# Altium project SerDser.PrjPCB
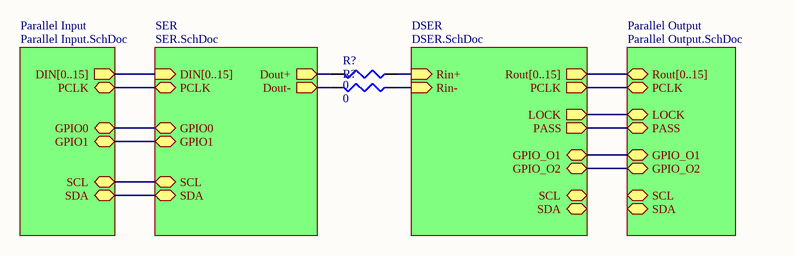
[diagram p0: Main.SchDoc]
5 sheets, 107 parts. Net scope: hierarchical (ports join the sheet entries above them; power ports are global).
Sheets:
  Main.SchDoc
    SER = SER.SchDoc
    DSER = DSER.SchDoc
    Parallel Input = Parallel Input.SchDoc
    Parallel Output = Parallel Output.SchDoc

## Sheet Main.SchDoc
size A4

### Parts
(Parts that share a designator on the sheet are numbered #1, #2 ... from top to bottom, then left to right.)
R?#1  value 0  [12Z-2010]  (hidden comment: Res3)
R?#2  value 0  [12Z-2010]  (hidden comment: Res3)

### Sub-sheets
DSER = DSER.SchDoc: Rout[0..15] (out), Rin+ (in), Rin- (in), GPIO_O1, GPIO_O2, PCLK (out), LOCK (out), PASS (out), SCL, SDA
Parallel Input = Parallel Input.SchDoc: DIN[0..15] (out), SCL, SDA, PCLK, GPIO0, GPIO1
Parallel Output = Parallel Output.SchDoc: Rout[0..15], PCLK, GPIO_O1, GPIO_O2, LOCK, PASS, SCL, SDA
SER = SER.SchDoc: DIN[0..15] (in), Dout+ (out), Dout- (out), GPIO0, GPIO1, SCL, SDA, PCLK

### Nets
Dout+: R?#1.2 ; sheet SER/Dout+
Dout-: R?#2.2 ; sheet SER/Dout-
GPIO0: sheet SER/GPIO0, sheet Parallel Input/GPIO0
GPIO1: sheet SER/GPIO1, sheet Parallel Input/GPIO1
PCLK: sheet SER/PCLK, sheet Parallel Input/PCLK
Rin+: R?#1.1 ; sheet DSER/Rin+
Rin-: R?#2.1 ; sheet DSER/Rin-
SCL: sheet SER/SCL, sheet Parallel Input/SCL
SDA: sheet SER/SDA, sheet Parallel Input/SDA
(unnamed): sheet DSER/GPIO_O1, sheet Parallel Output/GPIO_O1
(unnamed): sheet DSER/GPIO_O2, sheet Parallel Output/GPIO_O2
(unnamed): sheet DSER/PCLK, sheet Parallel Output/PCLK
(unnamed): sheet DSER/LOCK, sheet Parallel Output/LOCK
(unnamed): sheet DSER/PASS, sheet Parallel Output/PASS

### Buses and harness runs
bus sheet DSER/Rout[0..15] = sheet Parallel Output/Rout[0..15]
bus sheet Parallel Input/DIN[0..15] = sheet SER/DIN[0..15]

### Library data of the parts
R?#1 R?#2 = Res3: Resistor; Published: 8-Jun-2000; LatestRevisionDate: 29-May-2009; LatestRevisionNote: IPC-7351 Footprint Added.; PackageReference: J1-0603; Publisher: Altium Limited; PackageDescription: Chip Resistor

## Sheet SER.SchDoc
size A4
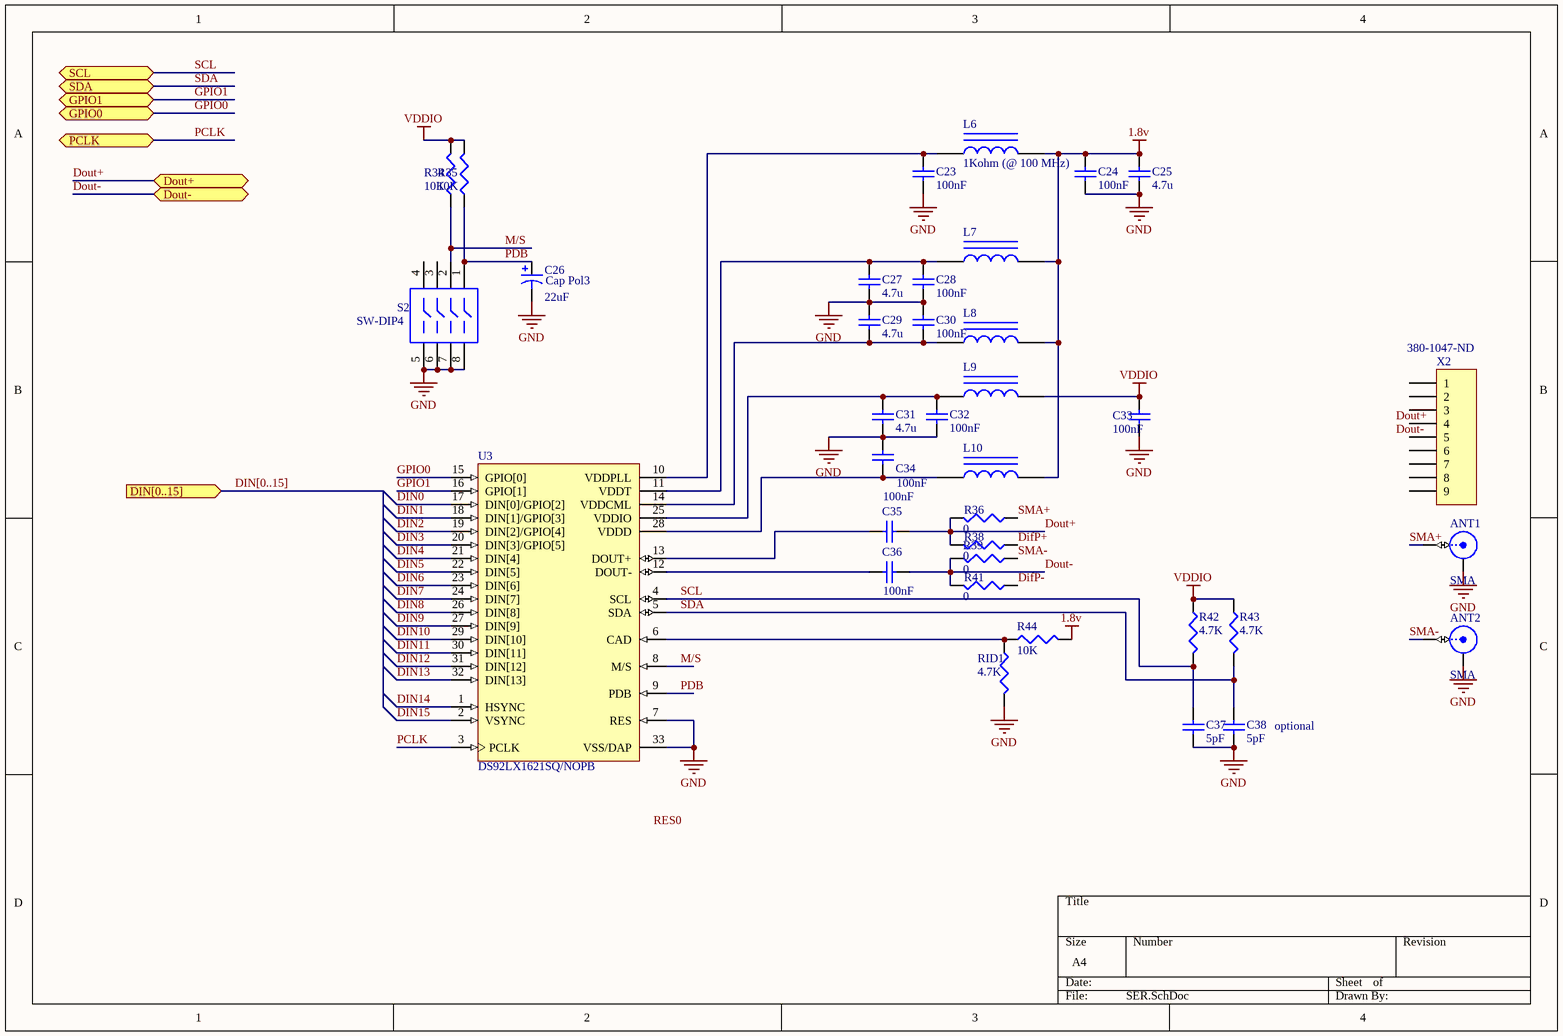
[diagram p1: SER.SchDoc]

### Parts
ANT1  SMA  [SMB_V-RJ45]
ANT2  SMA  [SMB_V-RJ45]
C23  value 100nF  [1608[0603]]  (hidden comment: Cap Semi)
C24  value 100nF  [1608[0603]]  (hidden comment: Cap Semi)
C25  value 4.7u  [1608[0603]]  (hidden comment: Cap Semi)
C26  Cap Pol3  value 22uF  [C0805]
C27  value 4.7u  [1608[0603]]  (hidden comment: Cap Semi)
C28  value 100nF  [1608[0603]]  (hidden comment: Cap Semi)
C29  value 4.7u  [1608[0603]]  (hidden comment: Cap Semi)
C30  value 100nF  [1608[0603]]  (hidden comment: Cap Semi)
C31  value 4.7u  [1608[0603]]  (hidden comment: Cap Semi)
C32  value 100nF  [1608[0603]]  (hidden comment: Cap Semi)
C33  value 100nF  [1608[0603]]  (hidden comment: Cap Semi)
C34  value 100nF  [1608[0603]]  (hidden comment: Cap Semi)
C35  value 100nF  [1608[0603]]  (hidden comment: Cap Semi)
C36  value 100nF  [1608[0603]]  (hidden comment: Cap Semi)
C37  value 5pF  [1608[0603]]  (hidden comment: Cap Semi)
C38  value 5pF  [1608[0603]]  (hidden comment: Cap Semi)
L6  1Kohm (@ 100 MHz)  [0805]
L7  (no value)  [0805]
L8  (no value)  [0805]
L9  (no value)  [0805]
L10  (no value)  [0805]
R34  value 10K  [12Z-2010]  (hidden comment: Res3)
R35  value 10K  [12Z-2010]  (hidden comment: Res3)
R36  value 0  [12Z-2010]  (hidden comment: Res3)
R38  value 0  [12Z-2010]  (hidden comment: Res3)
R39  value 0  [12Z-2010]  (hidden comment: Res3)
R41  value 0  [12Z-2010]  (hidden comment: Res3)
R42  value 4.7K  [12Z-2010]  (hidden comment: Res3)
R43  value 4.7K  [12Z-2010]  (hidden comment: Res3)
R44  value 10K  [12Z-2010]  (hidden comment: Res3)
RID1  value 4.7K  [12Z-2010]  (hidden comment: Res3)
S2  SW-DIP4  [DIP-8]
U3  DS92LX1621SQ/NOPB  [SQA32A]
X2  Supplier Part Number 1: 380-1047-ND  [rj-45]  (hidden comment: SS-7188S-A-NF)

### Ports
DIN[0..15] (in), Dout+, Dout-, GPIO0, GPIO1, PCLK, SCL, SDA

### Nets
1.8v: C24.2 C25.2 L6.2 L7.2 L8.2 L10.2 R44.2
GND: ANT1.2(Y) ANT2.2(Y) C23.1 C24.1 C25.1 C26.2 C27.1 C28.1 C29.2 C30.2 C31.1 C32.1 C33.1 C34.2 C37.1 C38.1 RID1.2 S2.5 S2.6 S2.7 S2.8 U3.7(RES) U3.33(VSS/DAP)
VDDIO: C33.2 L9.2 R34.1 R35.1 R42.1 R43.1
DifP+: R38.1
DifP-: R41.1
DIN0: U3.17(DIN[0]/GPIO[2])
DIN1: U3.18(DIN[1]/GPIO[3])
DIN2: U3.19(DIN[2]/GPIO[4])
DIN3: U3.20(DIN[3]/GPIO[5])
DIN4: U3.21(DIN[4])
DIN5: U3.22(DIN[5])
DIN6: U3.23(DIN[6])
DIN7: U3.24(DIN[7])
DIN8: U3.26(DIN[8])
DIN9: U3.27(DIN[9])
DIN10: U3.29(DIN[10])
DIN11: U3.30(DIN[11])
DIN12: U3.31(DIN[12])
DIN13: U3.32(DIN[13])
DIN14: U3.1(HSYNC)
DIN15: U3.2(VSYNC)
Dout+: C35.2 R36.2 R38.2 ; port Dout+
Dout-: C36.2 R39.2 R41.2 ; port Dout-
GPIO0: U3.15(GPIO[0]) ; port GPIO0
GPIO1: U3.16(GPIO[1]) ; port GPIO1
M/S: R34.2 S2.2 U3.8(M/S)
PCLK: U3.3(PCLK) ; port PCLK
PDB: C26.1 R35.2 S2.1 U3.9(PDB)
SCL: C37.2 R42.2 U3.4(SCL) ; port SCL
SDA: C38.2 R43.2 U3.5(SDA) ; port SDA
SMA+: ANT1.1(IO) R36.1
SMA-: ANT2.1(IO) R39.1
NetC23_2: C23.2 L6.1 U3.10(VDDPLL)
NetC27_2: C27.2 C28.2 L7.1 U3.11(VDDT)
NetC29_1: C29.1 C30.1 L8.1 U3.14(VDDCML)
NetC31_2: C31.2 C32.2 L9.1 U3.25(VDDIO)
NetC34_1: C34.1 L10.1 U3.28(VDDD)
NetC35_1: C35.1 U3.13(DOUT+)
NetC36_1: C36.1 U3.12(DOUT-)
NetR44_1: R44.1 RID1.1 U3.6(CAD)

Not connected (* = marked no-connect by the designer): S2 3 4; X2 1 2 3 4 5 6 7 8 9

### Buses and harness runs
bus DIN[0..15] = port DIN[0..15]

### Notes on the sheet
- (near C38) optional
- Labels drawn without touching a wire or pin: Dout+, Dout-, RES0

### Library data of the parts
ANT1 ANT2 = SMA-J-P-H-ST-EM1: SMA 50 Ohm Edge Mount; Lager: No; PN RS: *
C23-C25 C27-C34 C37 C38 = Cap Semi: Capacitor (Semiconductor SIM Model); Published: 8-Jun-2000; LatestRevisionDate: 29-May-2009; LatestRevisionNote: IPC-7351 Footprint Added.; PackageReference: C1206; Publisher: Altium Limited; PackageDescription: Chip Capacitor
C26 = Cap Pol3: Polarized Capacitor (Surface Mount); Published: 8-Jun-2000; LatestRevisionDate: 29-May-2009; LatestRevisionNote: IPC-7351 Footprint Added.; PackageReference: C0805; Publisher: Altium Limited; PackageDescription: Chip Capacitor
C35 C36 = Cap Semi: CAP CER 0.1UF 50V X7R 0603; Published: 8-Jun-2000; LatestRevisionDate: 29-May-2009; LatestRevisionNote: IPC-7351 Footprint Added.; PackageReference: C1206; Publisher: Altium Limited; PackageDescription: Chip Capacitor
L6 = Inductor Iron: Impedance = 1Kohm (@ 100 MHz)  low DC resistance (<1ohm); Published: 24-Mar-1999; LatestRevisionDate: 17-Jul-2002; LatestRevisionNote: Re-released for DXP Platform.; PackageReference: AXIAL-0.9; Publisher: Altium Limited; PackageDescription: Axial Device, Thru-Hole; 2 Leads; 0.9 in Pin Spacing
L7-L10 = Inductor Iron: Impedance = 1 kohm (@ 100 MHz)  low DC resistance (<1ohm); Published: 24-Mar-1999; LatestRevisionDate: 17-Jul-2002; LatestRevisionNote: Re-released for DXP Platform.; PackageReference: AXIAL-0.9; Publisher: Altium Limited; PackageDescription: Axial Device, Thru-Hole; 2 Leads; 0.9 in Pin Spacing
R34-R36 R38 R39 R41-R44 RID1 = Res3: Resistor; Published: 8-Jun-2000; LatestRevisionDate: 29-May-2009; LatestRevisionNote: IPC-7351 Footprint Added.; PackageReference: J1-0603; Publisher: Altium Limited; PackageDescription: Chip Resistor
S2 = SW-DIP4: DIP Switch; Published: 24-Mar-1999; LatestRevisionDate: 17-Jul-2002; LatestRevisionNote: Re-released for DXP Platform.; PackageReference: DIP-8; Publisher: Altium Limited
U3 = DS92LX1621SQ/NOPB: 10 - 50 MHz DC-Balanced Channel Link III Bi-Directional Control Serializer, 32 pin LLP; Manufacturer: National Semiconductor; PackageTopMarking: NS*UZXYTT*LX1621; PowerWise: N; CompType: Interface IC; Published: 16-Nov-2010; DatasheetVersion: Sep-2010; PackageVersion: revB, Oct-2009; PackageReference: SQA32A; Publisher: Altium Limited; PackageDescription: LLP, Quad, 5 x 5 x 0.8mm, 32 Lead, 0.5mm Pitch, No Pullback 3.1 x 3.1 Exposed Pad; PartNumber: DS92LX1621SQ/NOPB; RoHS: Y; PinCount: 32; ComponentLink1Description: DS92LX1621 Datasheet; ComponentLink1URL: http://www.national.com/ds/DS/DS92LX1621.pdf; ComponentLink2Description: DS92LX1621 Web Page; ComponentLink2URL: http://www.national.com/pf/DS/DS92LX1621.html; ComponentLink3Description: SQA32A Package Page; ComponentLink3URL: http://www.national.com/packaging/folders/sqa32a.html
X2 = Header 9: CONN MOD JACK 8P8C R/A SHIELDED; Manufacturer: Stewart Connector; Number of Positions/Contacts: 8p8c (RJ45, Ethernet); Number of Ports: 1; Ratings: Cat5e; LED Color: Does Not Contain LED; Tab Direction: Down; LatestRevisionDate: 17-Jul-2002; LatestRevisionNote: Re-released for DXP Platform.; Publisher: Altium Limited; Supplier 1: Digi-Key; Manufacturer Part Number: SS-7188S-A-NF; RoHS: RoHS Compliant; Category: Connectors, Interconnects; Stock 1: 7949; Pricing 1: 1=1.7, 10=1.546, 25=1.4512, 50=1.3882, 100=1.3251, 250=1.19892, 500=1.10426, 1000=0.9465, 2500=0.8834 (USD); Packaging: Bulk; Part Status: Active; Connector Type: Jack; Number of Rows: 1; Mounting Type: Through Hole; Orientation: 90° Angle (Right); Termination: Solder; Shielding: Shielded; Features: Board Lock; Ingress Protection: -; Contact Material: Copper Alloy; Contact Finish: Gold; Contact Finish Thickness: 30µin (0.76µm); Housing Material: Thermoplastic; Operating Temperature: -40°C ~ 85°C; ComponentLink1URL: https://belfuse.com/resources/StewartConnector/Stewart%20Data%20Sheets/CT710001.pdf; ComponentLink1Description: https://belfuse.com/resources/StewartConnector/Stewart%20Data%20Sheets/CT710001.pdf

## Sheet DSER.SchDoc
size A4
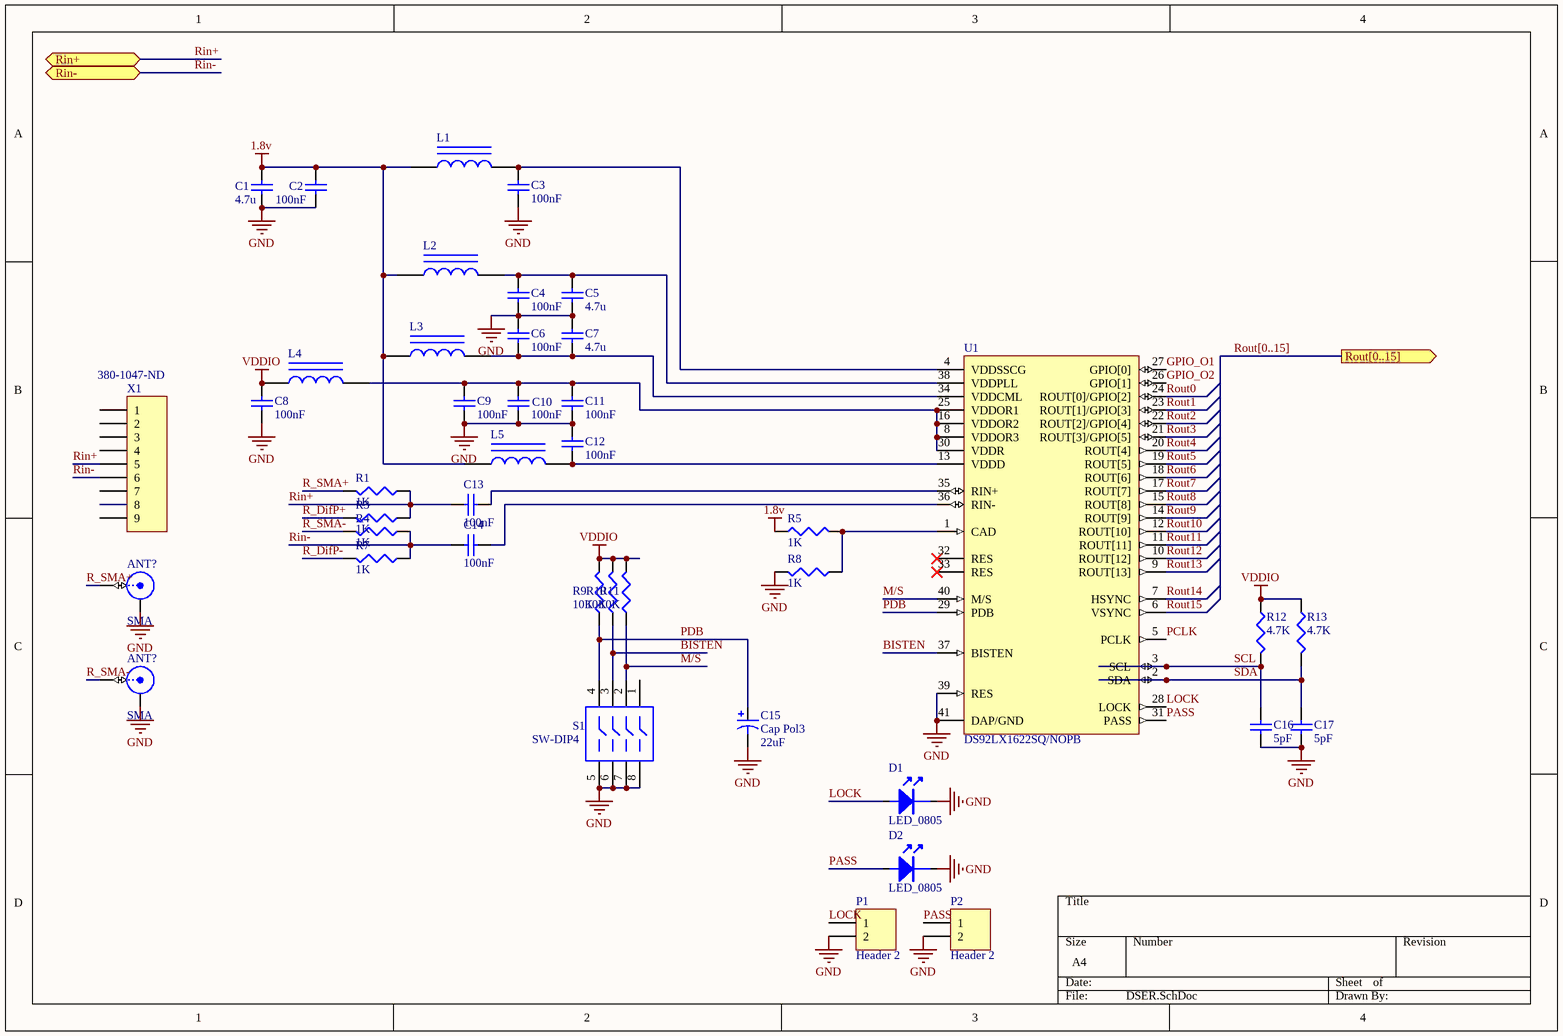
[diagram p2: DSER.SchDoc]

### Parts
(Parts that share a designator on the sheet are numbered #1, #2 ... from top to bottom, then left to right.)
ANT?#1  SMA  [SMB_V-RJ45]
ANT?#2  SMA  [SMB_V-RJ45]
C1  value 4.7u  [1608[0603]]  (hidden comment: Cap Semi)
C2  value 100nF  [1608[0603]]  (hidden comment: Cap Semi)
C3  value 100nF  [1608[0603]]  (hidden comment: Cap Semi)
C4  value 100nF  [1608[0603]]  (hidden comment: Cap Semi)
C5  value 4.7u  [1608[0603]]  (hidden comment: Cap Semi)
C6  value 100nF  [1608[0603]]  (hidden comment: Cap Semi)
C7  value 4.7u  [1608[0603]]  (hidden comment: Cap Semi)
C8  value 100nF  [1608[0603]]  (hidden comment: Cap Semi)
C9  value 100nF  [1608[0603]]  (hidden comment: Cap Semi)
C10  value 100nF  [1608[0603]]  (hidden comment: Cap Semi)
C11  value 100nF  [1608[0603]]  (hidden comment: Cap Semi)
C12  value 100nF  [1608[0603]]  (hidden comment: Cap Semi)
C13  value 100nF  [1608[0603]]  (hidden comment: Cap Semi)
C14  value 100nF  [1608[0603]]  (hidden comment: Cap Semi)
C15  Cap Pol3  value 22uF  [C0805]
C16  value 5pF  [1608[0603]]  (hidden comment: Cap Semi)
C17  value 5pF  [1608[0603]]  (hidden comment: Cap Semi)
D1  LED_0805  [LED0805]
D2  LED_0805  [LED0805]
L1  (no value)  [0805]
L2  (no value)  [0805]
L3  (no value)  [0805]
L4  (no value)  [0805]
L5  (no value)  [0805]
P1  Header 2  [HDR1X2]
P2  Header 2  [HDR1X2]
R1  value 1K  [12Z-2010]  (hidden comment: Res3)
R3  value 1K  [12Z-2010]  (hidden comment: Res3)
R4  value 1K  [12Z-2010]  (hidden comment: Res3)
R5  value 1K  [12Z-2010]  (hidden comment: Res3)
R7  value 1K  [12Z-2010]  (hidden comment: Res3)
R8  value 1K  [12Z-2010]  (hidden comment: Res3)
R9  value 10K  [12Z-2010]  (hidden comment: Res3)
R10  value 10K  [12Z-2010]  (hidden comment: Res3)
R11  value 10K  [12Z-2010]  (hidden comment: Res3)
R12  value 4.7K  [12Z-2010]  (hidden comment: Res3)
R13  value 4.7K  [12Z-2010]  (hidden comment: Res3)
S1  SW-DIP4  [DIP-8]
U1  DS92LX1622SQ/NOPB  [SQA40A]
X1  Supplier Part Number 1: 380-1047-ND  [rj-45]  (hidden comment: SS-7188S-A-NF)

### Ports
Rin+, Rin-, Rout[0..15] (out)

### Nets
1.8v: C1.2 C2.2 L1.2 L2.2 L3.2 L5.2 R5.2
GND: ANT?#1.2(Y) ANT?#2.2(Y) C1.1 C2.1 C3.1 C4.1 C5.1 C6.2 C7.2 C8.1 C9.2 C10.2 C11.2 C12.1 C15.2 C16.1 C17.1 D1.2 D2.2 P1.2 P2.2 R8.1 S1.5 S1.6 S1.7 S1.8 U1.39(RES) U1.41(DAP/GND)
VDDIO: C8.2 L4.2 R9.1 R10.1 R11.1 R12.1 R13.1
BISTEN: R10.2 S1.3 U1.37(BISTEN)
GPIO_O1: U1.27(GPIO[0])
GPIO_O2: U1.26(GPIO[1])
LOCK: D1.1 P1.1 U1.28(LOCK)
M/S: R11.2 S1.2 U1.40(M/S)
PASS: D2.1 P2.1 U1.31(PASS)
PCLK: U1.5(PCLK)
PDB: C15.1 R9.2 S1.4 U1.29(PDB)
R_DifP+: R3.1
R_DifP-: R7.1
R_SMA+: ANT?#1.1(IO) R1.1
R_SMA-: ANT?#2.1(IO) R4.1
Rin+: C13.2 R1.2 R3.2 X1.5 ; port Rin+
Rin-: C14.2 R4.2 R7.2 X1.6 ; port Rin-
Rout0: U1.24(ROUT[0]/GPIO[2])
Rout1: U1.23(ROUT[1]/GPIO[3])
Rout2: U1.22(ROUT[2]/GPIO[4])
Rout3: U1.21(ROUT[3]/GPIO[5])
Rout4: U1.20(ROUT[4])
Rout5: U1.19(ROUT[5])
Rout6: U1.18(ROUT[6])
Rout7: U1.17(ROUT[7])
Rout8: U1.15(ROUT[8])
Rout9: U1.14(ROUT[9])
Rout10: U1.12(ROUT[10])
Rout11: U1.11(ROUT[11])
Rout12: U1.10(ROUT[12])
Rout13: U1.9(ROUT[13])
Rout14: U1.7(HSYNC)
Rout15: U1.6(VSYNC)
SCL: C16.2 R12.2 U1.3(SCL)
SDA: C17.2 R13.2 U1.2(SDA)
NetC3_2: C3.2 L1.1 U1.4(VDDSSCG)
NetC4_2: C4.2 C5.2 L2.1 U1.38(VDDPLL)
NetC6_1: C6.1 C7.1 L3.1 U1.34(VDDCML)
NetC9_1: C9.1 C10.1 C11.1 L4.1 U1.8(VDDOR3) U1.16(VDDOR2) U1.25(VDDOR1) U1.30(VDDR)
NetC12_2: C12.2 L5.1 U1.13(VDDD)
NetC13_1: C13.1 U1.35(RIN+)
NetC14_1: C14.1 U1.36(RIN-)
NetR5_1: R5.1 R8.2 U1.1(CAD)

Not connected (* = marked no-connect by the designer): S1 1; U1 32(RES)* 33(RES)*; X1 1 2 3 4 7 8 9

### Buses and harness runs
bus Rout[0..15] = port Rout[0..15]

### Library data of the parts
ANT?#1 ANT?#2 = SMA-J-P-H-ST-EM1: SMA 50 Ohm Edge Mount; Lager: No; PN RS: *
C1-C14 C16 C17 = Cap Semi: Capacitor (Semiconductor SIM Model); Published: 8-Jun-2000; LatestRevisionDate: 29-May-2009; LatestRevisionNote: IPC-7351 Footprint Added.; PackageReference: C1206; Publisher: Altium Limited; PackageDescription: Chip Capacitor
C15 = Cap Pol3: Polarized Capacitor (Surface Mount); Published: 8-Jun-2000; LatestRevisionDate: 29-May-2009; LatestRevisionNote: IPC-7351 Footprint Added.; PackageReference: C0805; Publisher: Altium Limited; PackageDescription: Chip Capacitor
D1 D2 = LED: Blue
L1-L5 = Inductor Iron: as L7 on sheet SER; Published: 24-Mar-1999; LatestRevisionDate: 17-Jul-2002; LatestRevisionNote: Re-released for DXP Platform.; PackageReference: AXIAL-0.9; Publisher: Altium Limited; PackageDescription: Axial Device, Thru-Hole; 2 Leads; 0.9 in Pin Spacing
P1 P2 = Header 2: Header, 2-Pin; LatestRevisionDate: 17-Jul-2002; LatestRevisionNote: Re-released for DXP Platform.; Publisher: Altium Limited
R1 R3-R5 R7-R13 = Res3: Resistor; Published: 8-Jun-2000; LatestRevisionDate: 29-May-2009; LatestRevisionNote: IPC-7351 Footprint Added.; PackageReference: J1-0603; Publisher: Altium Limited; PackageDescription: Chip Resistor
S1 = SW-DIP4: DIP Switch; Published: 24-Mar-1999; LatestRevisionDate: 17-Jul-2002; LatestRevisionNote: Re-released for DXP Platform.; PackageReference: DIP-8; Publisher: Altium Limited
U1 = DS92LX1622SQ/NOPB: 10 - 50 MHz DC-Balanced Channel Link III Bi-Directional Control Serializer, 40 pin LLP; Manufacturer: National Semiconductor; PackageTopMarking: NS*UZXYTTE#*LX1622; PowerWise: N; CompType: Interface IC; Published: 16-Nov-2010; DatasheetVersion: Sep-2010; PackageVersion: revB, Mar-2004; PackageReference: SQA40A; Publisher: Altium Limited; PackageDescription: LLP, Plastic, Quad, 6 x 6 x 0.8mm Body, 40 Lead, 0.5mm Pitch, No Pullback; PartNumber: DS92LX1622SQ/NOPB; RoHS: Y; PinCount: 40; ComponentLink1Description: DS92LX1622 Datasheet; ComponentLink1URL: http://www.national.com/ds/DS/DS92LX1622.pdf; ComponentLink2Description: DS92LX1622 Web Page; ComponentLink2URL: http://www.national.com/pf/DS/DS92LX1622.html; ComponentLink3Description: SQA40A Package Page; ComponentLink3URL: http://www.national.com/packaging/folders/sqa40a.html
X1 = Header 9: as X2 on sheet SER; LatestRevisionDate: 17-Jul-2002; LatestRevisionNote: Re-released for DXP Platform.; Publisher: Altium Limited; Supplier 1: Digi-Key; Manufacturer Part Number: SS-7188S-A-NF; RoHS: RoHS Compliant; Category: Connectors, Interconnects; Stock 1: 7949; Pricing 1: 1=1.7, 10=1.546, 25=1.4512, 50=1.3882, 100=1.3251, 250=1.19892, 500=1.10426, 1000=0.9465, 2500=0.8834 (USD); Packaging: Bulk; Part Status: Active; Connector Type: Jack; Number of Rows: 1; Mounting Type: Through Hole; Orientation: 90° Angle (Right); Termination: Solder; Shielding: Shielded; Features: Board Lock; Ingress Protection: -; Contact Material: Copper Alloy; Contact Finish: Gold; Contact Finish Thickness: 30µin (0.76µm); Housing Material: Thermoplastic; Operating Temperature: -40°C ~ 85°C; ComponentLink1URL: https://belfuse.com/resources/StewartConnector/Stewart%20Data%20Sheets/CT710001.pdf; ComponentLink1Description: https://belfuse.com/resources/StewartConnector/Stewart%20Data%20Sheets/CT710001.pdf

## Sheet Parallel Input.SchDoc
size A4
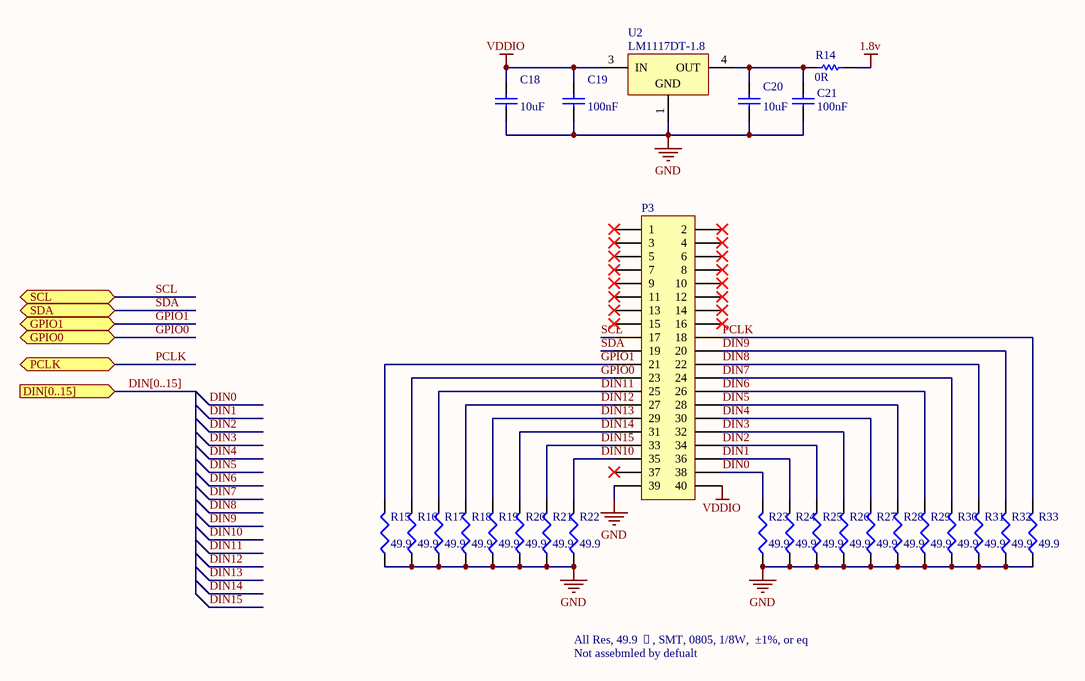
[diagram p3: Parallel Input.SchDoc]

### Parts
C18  10uF  [0805]
C19  100nF  [0603]
C20  10uF  [0805]
C21  100nF  [0603]
P3  WE-2,54mm_Box Header 61204020621  [61204020621]  (value not drawn)
R14  0R  [0805]
R15  value 49.9  [12Z-2010]  (hidden comment: Res3)
R16  value 49.9  [12Z-2010]  (hidden comment: Res3)
R17  value 49.9  [12Z-2010]  (hidden comment: Res3)
R18  value 49.9  [12Z-2010]  (hidden comment: Res3)
R19  value 49.9  [12Z-2010]  (hidden comment: Res3)
R20  value 49.9  [12Z-2010]  (hidden comment: Res3)
R21  value 49.9  [12Z-2010]  (hidden comment: Res3)
R22  value 49.9  [12Z-2010]  (hidden comment: Res3)
R23  value 49.9  [12Z-2010]  (hidden comment: Res3)
R24  value 49.9  [12Z-2010]  (hidden comment: Res3)
R25  value 49.9  [12Z-2010]  (hidden comment: Res3)
R26  value 49.9  [12Z-2010]  (hidden comment: Res3)
R27  value 49.9  [12Z-2010]  (hidden comment: Res3)
R28  value 49.9  [12Z-2010]  (hidden comment: Res3)
R29  value 49.9  [12Z-2010]  (hidden comment: Res3)
R30  value 49.9  [12Z-2010]  (hidden comment: Res3)
R31  value 49.9  [12Z-2010]  (hidden comment: Res3)
R32  value 49.9  [12Z-2010]  (hidden comment: Res3)
R33  value 49.9  [12Z-2010]  (hidden comment: Res3)
U2  LM1117DT-1.8  [TD03B_N]

### Ports
DIN[0..15] (in), GPIO0, GPIO1, PCLK, SCL, SDA

### Nets
1.8v: R14.2
GND: C18.2 C19.2 C20.2 C21.2 P3.39 R15.1 R16.1 R17.1 R18.1 R19.1 R20.1 R21.1 R22.1 R23.1 R24.1 R25.1 R26.1 R27.1 R28.1 R29.1 R30.1 R31.1 R32.1 R33.1 U2.1(GND)
VDDIO: C18.1 C19.1 P3.40 U2.3(IN)
DIN0: P3.38 R23.2
DIN1: P3.36 R24.2
DIN2: P3.34 R25.2
DIN3: P3.32 R26.2
DIN4: P3.30 R27.2
DIN5: P3.28 R28.2
DIN6: P3.26 R29.2
DIN7: P3.24 R30.2
DIN8: P3.22 R31.2
DIN9: P3.20 R32.2
DIN10: P3.35 R22.2
DIN11: P3.25 R17.2
DIN12: P3.27 R18.2
DIN13: P3.29 R19.2
DIN14: P3.31 R20.2
DIN15: P3.33 R21.2
GPIO0: P3.23 R16.2 ; port GPIO0
GPIO1: P3.21 R15.2 ; port GPIO1
PCLK: P3.18 R33.2 ; port PCLK
SCL: P3.17 ; port SCL
SDA: P3.19 ; port SDA
NetC20_1: C20.1 C21.1 R14.1 U2.4(OUT)

Not connected (* = marked no-connect by the designer): P3 1* 2* 3* 4* 5* 6* 7* 8* 9* 10* 11* 12* 13* 14* 15* 16* 37*

### Buses and harness runs
bus DIN[0..15] = port DIN[0..15]

### Notes on the sheet
- Not assebmled by defualt
- All Res, 49.9 , SMT, 0805, 1/8W,  ±1%, or eq

### Library data of the parts
C18-C21 = Cap: Capacitor; Published: 8-Jun-2000; LatestRevisionDate: 17-Jul-2002; LatestRevisionNote: Re-released for DXP Platform.; PackageReference: RAD-0.3; Publisher: Altium Limited; PackageDescription: Radial Cap, Thru-Hole; 2 Leads; 0.3 in Pin Spacing
  C18 C20: Value: 10uF
  C19 C21: Value: 100nF
P3 = WE-2,54mm_Box Header 61204020621: WR-BHD 2.54mm Male SMT Box Header; Manufacturer: W¨¹rth Elektronik eiSos GmbH; ComponentLink1 Description: Manufacturer; ComponentLink2 Description: Datasheet; NoPins: 40; Created Date: 8 May 2013; partNo: 61204020621; ComponentLink1URL: http://www.we-online.com; ComponentLink2URL: http://katalog.we-online.de/em/datasheet/6120xx20621.pdf; Created by: Karrer Zheng
R14 = Res Semi: Semiconductor Resistor; Published: 8-Jun-2010; LatestRevisionDate: 17-Jul-2002; LatestRevisionNote: Re-released for DXP Platform.; Publisher: Altium Limited; Value: 0R
R15-R33 = Res3: Resistor; Published: 8-Jun-2000; LatestRevisionDate: 29-May-2009; LatestRevisionNote: IPC-7351 Footprint Added.; Publisher: Altium Limited; PackageDescription: Chip Resistor
  R15: PackageReference: 0201
  R16-R32: PackageReference: J1-0603
  R33: PackageReference: 0805
U2 = LM1117DT-3.3: 800mA Low-Dropout Linear Regulator, 3-pin TO-252; Manufacturer: National Semiconductor; PackageTopMarking: NSUZXYTT*LM1117*DT-3.3; PowerWise: N; CompType: LDO IC; Published: 4-Dec-2008; DatasheetVersion: Apr-2006; PackageVersion: revD, Feb-2009; PackageReference: TD03B; Publisher: Altium Limited; PackageDescription: TO252, Molded, Jedec, 6.8 x 6.10 x 2.30mm Body, 3 Lead, 2.28mm Pitch, Surface Mount; Supplier 1: Farnell; Supplier Part Number 1: 9486275; Supplier 2: Farnell; Supplier Part Number 2: 1523829; PartNumber: LM1117DT-3.3; RoHS: N; PinCount: 3; Code_JEDEC: TO-252-AA; ComponentLink1Description: LM1117 Datasheet; ComponentLink1URL: http://www.national.com/ds/LM/LM1117.pdf; ComponentLink2Description: LM1117 Web Page; ComponentLink2URL: http://www.national.com/pf/LM/LM1117.html; ComponentLink3Description: TD03B Package Page; ComponentLink3URL: http://www.national.com/packaging/folders/td03b.html

## Sheet Parallel Output.SchDoc
size A4
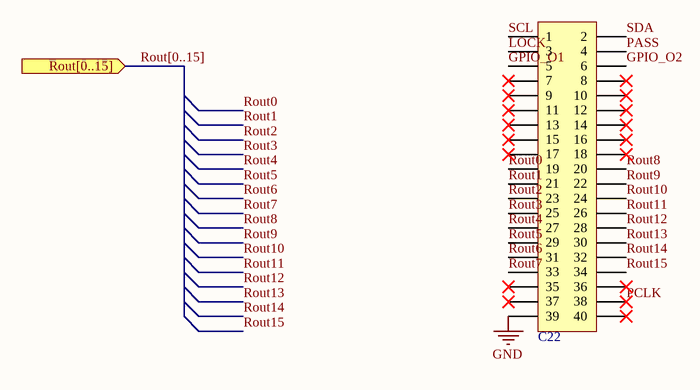
[diagram p4: Parallel Output.SchDoc]

### Parts
C22  WE-2,54mm_Box Header 61204020621  [61204020621]  (value not drawn)

### Ports
Rout[0..15] (in)

### Nets
GND: C22.39
GPIO_O1: C22.5
GPIO_O2: C22.6
LOCK: C22.3
PASS: C22.4
PCLK: C22.38
Rout0: C22.19
Rout1: C22.21
Rout2: C22.23
Rout3: C22.25
Rout4: C22.27
Rout5: C22.29
Rout6: C22.31
Rout7: C22.33
Rout8: C22.20
Rout9: C22.22
Rout10: C22.24
Rout11: C22.26
Rout12: C22.28
Rout13: C22.30
Rout14: C22.32
Rout15: C22.34
SCL: C22.1
SDA: C22.2

Not connected (* = marked no-connect by the designer): C22 7* 8* 9* 10* 11* 12* 13* 14* 15* 16* 17* 18* 35* 36* 37* 40*

### Buses and harness runs
bus Rout[0..15] = port Rout[0..15]

### Library data of the parts
C22 = WE-2,54mm_Box Header 61204020621: as P3 on sheet Parallel Input; Created Date: 8 May 2013; partNo: 61204020621; ComponentLink1URL: http://www.we-online.com; ComponentLink2URL: http://katalog.we-online.de/em/datasheet/6120xx20621.pdf; Created by: Karrer Zheng

## Nets that join several sheets
1.8v: SER (7 pins), DSER (7 pins), Parallel Input (R14.2)
GND: SER (23 pins), DSER (28 pins), Parallel Input (25 pins), Parallel Output (C22.39)
VDDIO: SER (6 pins), DSER (7 pins), Parallel Input (C18.1 C19.1 P3.40 U2.3)
DIN0: SER (U3.17), Parallel Input (P3.38 R23.2)
DIN1: SER (U3.18), Parallel Input (P3.36 R24.2)
DIN2: SER (U3.19), Parallel Input (P3.34 R25.2)
DIN3: SER (U3.20), Parallel Input (P3.32 R26.2)
DIN4: SER (U3.21), Parallel Input (P3.30 R27.2)
DIN5: SER (U3.22), Parallel Input (P3.28 R28.2)
DIN6: SER (U3.23), Parallel Input (P3.26 R29.2)
DIN7: SER (U3.24), Parallel Input (P3.24 R30.2)
DIN8: SER (U3.26), Parallel Input (P3.22 R31.2)
DIN9: SER (U3.27), Parallel Input (P3.20 R32.2)
DIN10: SER (U3.29), Parallel Input (P3.35 R22.2)
DIN11: SER (U3.30), Parallel Input (P3.25 R17.2)
DIN12: SER (U3.31), Parallel Input (P3.27 R18.2)
DIN13: SER (U3.32), Parallel Input (P3.29 R19.2)
DIN14: SER (U3.1), Parallel Input (P3.31 R20.2)
DIN15: SER (U3.2), Parallel Input (P3.33 R21.2)
Dout+: Main (R?#1.2), SER (C35.2 R36.2 R38.2)
Dout-: Main (R?#2.2), SER (C36.2 R39.2 R41.2)
GPIO0: SER (U3.15), Parallel Input (P3.23 R16.2)
GPIO1: SER (U3.16), Parallel Input (P3.21 R15.2)
PCLK: SER (U3.3), Parallel Input (P3.18 R33.2)
Rin+: Main (R?#1.1), DSER (C13.2 R1.2 R3.2 X1.5)
Rin-: Main (R?#2.1), DSER (C14.2 R4.2 R7.2 X1.6)
Rout0: DSER (U1.24), Parallel Output (C22.19)
Rout1: DSER (U1.23), Parallel Output (C22.21)
Rout2: DSER (U1.22), Parallel Output (C22.23)
Rout3: DSER (U1.21), Parallel Output (C22.25)
Rout4: DSER (U1.20), Parallel Output (C22.27)
Rout5: DSER (U1.19), Parallel Output (C22.29)
Rout6: DSER (U1.18), Parallel Output (C22.31)
Rout7: DSER (U1.17), Parallel Output (C22.33)
Rout8: DSER (U1.15), Parallel Output (C22.20)
Rout9: DSER (U1.14), Parallel Output (C22.22)
Rout10: DSER (U1.12), Parallel Output (C22.24)
Rout11: DSER (U1.11), Parallel Output (C22.26)
Rout12: DSER (U1.10), Parallel Output (C22.28)
Rout13: DSER (U1.9), Parallel Output (C22.30)
Rout14: DSER (U1.7), Parallel Output (C22.32)
Rout15: DSER (U1.6), Parallel Output (C22.34)
SCL: SER (C37.2 R42.2 U3.4), Parallel Input (P3.17)
SDA: SER (C38.2 R43.2 U3.5), Parallel Input (P3.19)